# Altium schematic sheet Top level.SchDoc: Top level
size A3; ApprovedBy: FD; Engineer: AAZ; Organization: Railnova; Address1: 58 rue des tanneurs; Address2: B1000 Brussels; Address3: Belgium; SheetNumber: 1; SheetTotal: 2
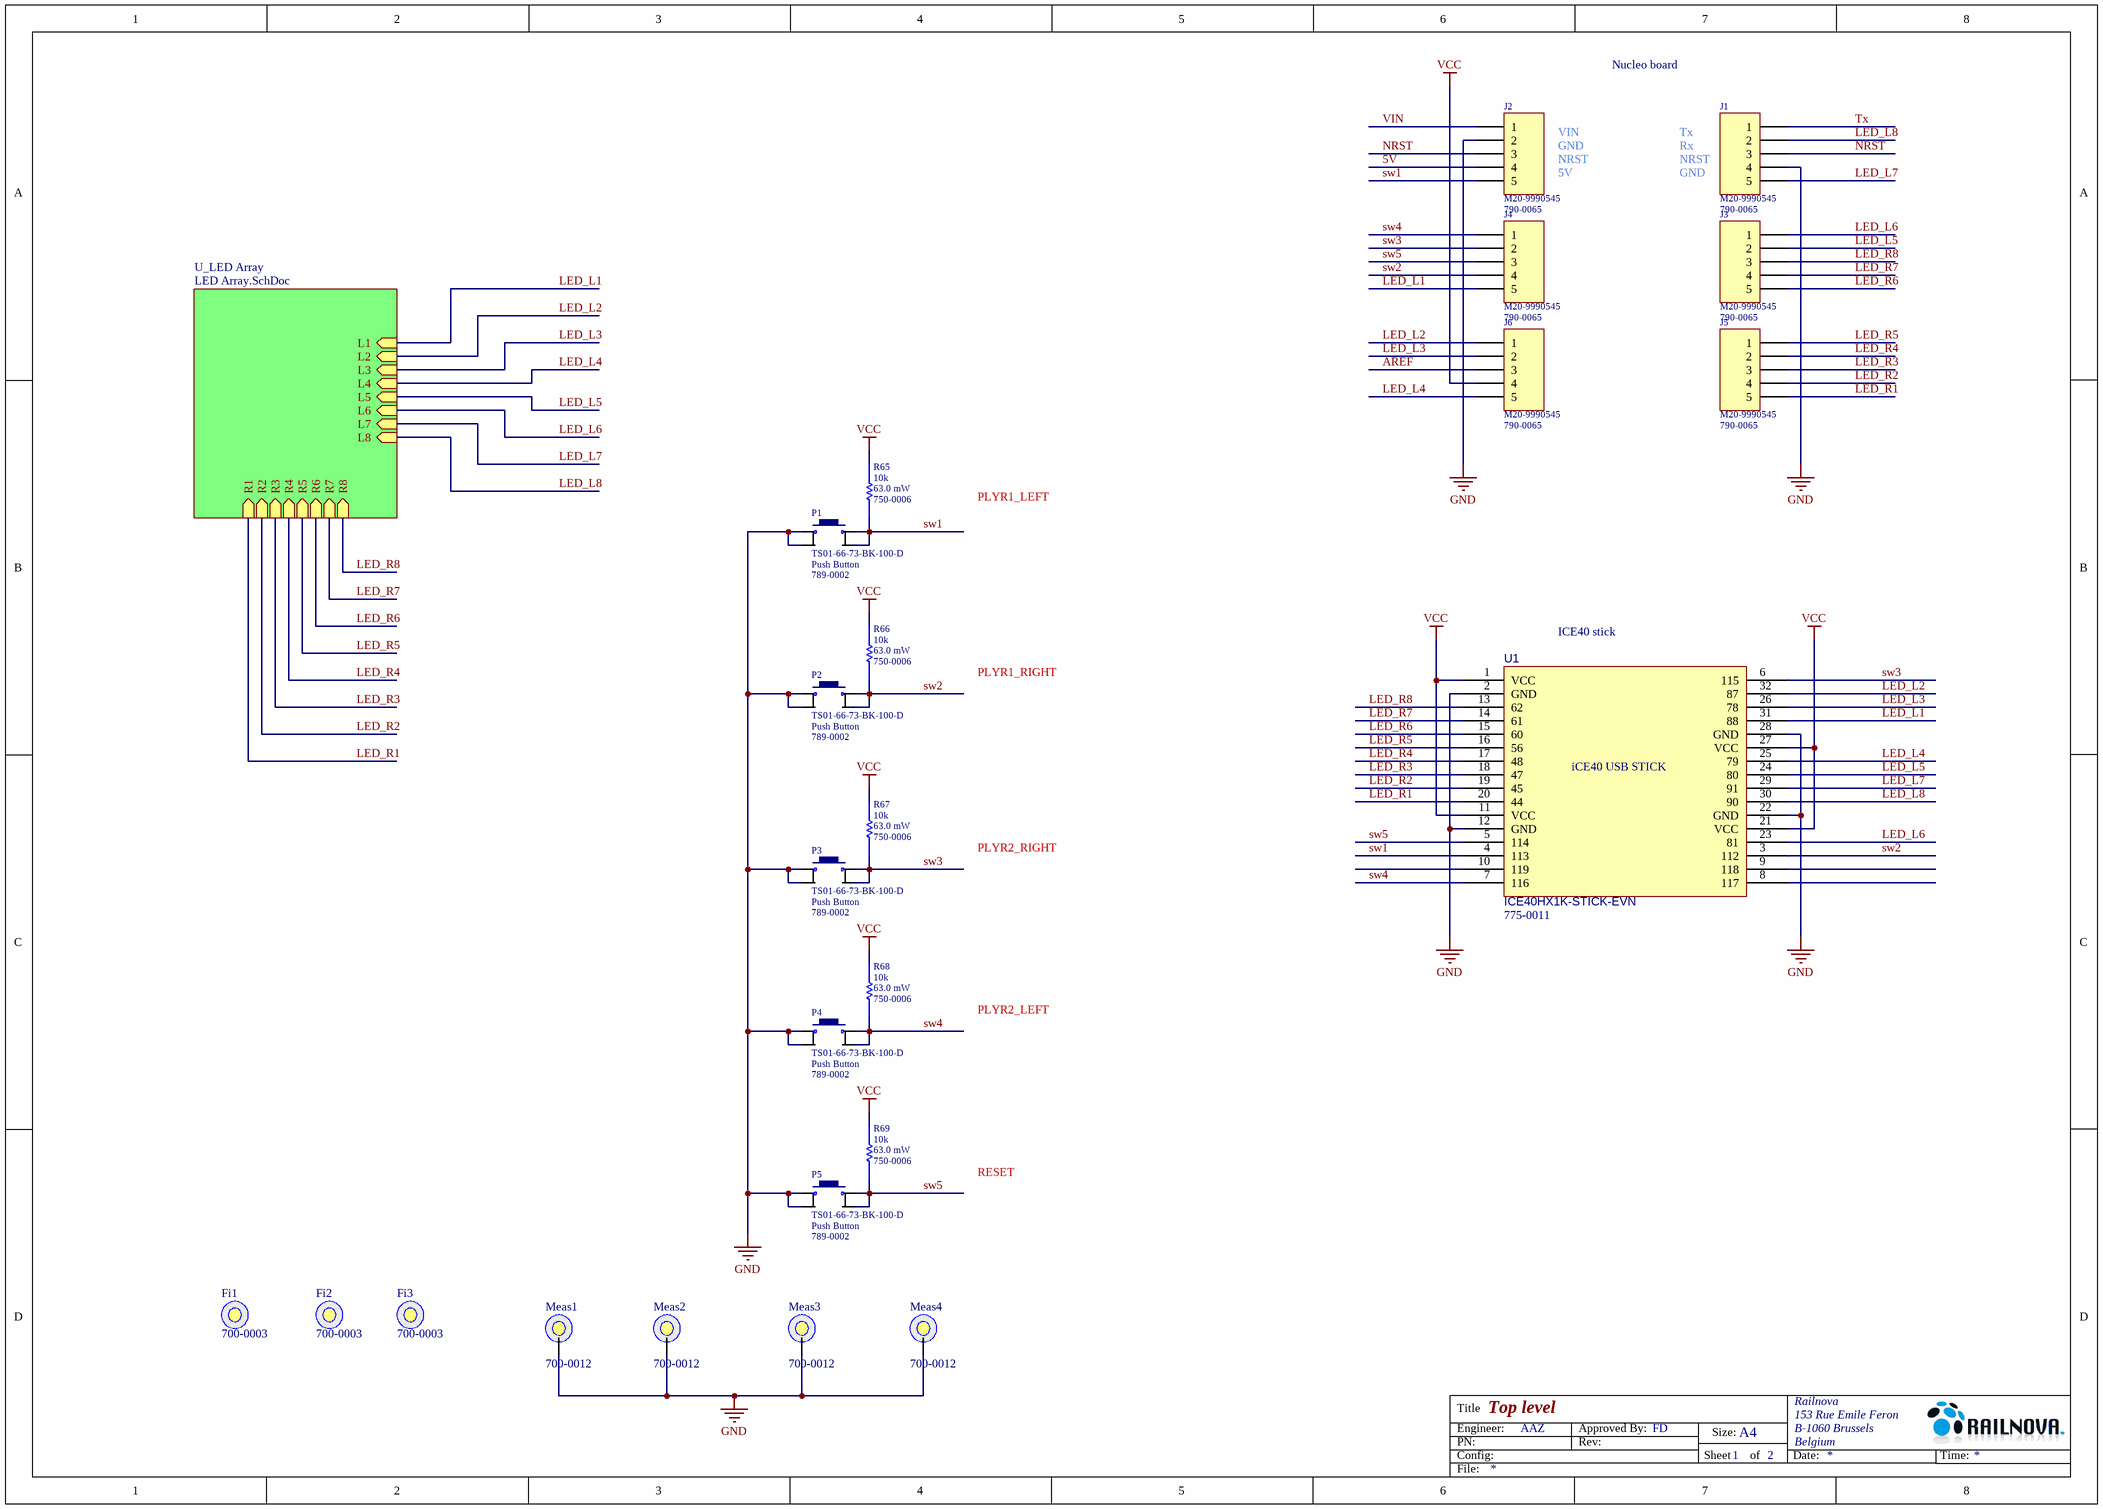
[diagram p0: Top level.SchDoc]

## Parts
Fi1  700-0003  [Fiducial_1mm]
Fi2  700-0003  [Fiducial_1mm]
Fi3  700-0003  [Fiducial_1mm]
J1  M20-9990545  Part Number: 790-0065  [CON-HDR-VER-M1X5]
J2  M20-9990545  Part Number: 790-0065  [CON-HDR-VER-M1X5]
J3  M20-9990545  Part Number: 790-0065  [CON-HDR-VER-M1X5]
J4  M20-9990545  Part Number: 790-0065  [CON-HDR-VER-M1X5]
J5  M20-9990545  Part Number: 790-0065  [CON-HDR-VER-M1X5]
J6  M20-9990545  Part Number: 790-0065  [CON-HDR-VER-M1X5]
Meas1  700-0012  [FOX_measure_point_3mm]
Meas2  700-0012  [FOX_measure_point_3mm]
Meas3  700-0012  [FOX_measure_point_3mm]
Meas4  700-0012  [FOX_measure_point_3mm]
P1  TS01-66-73-BK-100-D  Component Type: Push Button  Part Number: 789-0002  [TS01-66-70-BK]
P2  TS01-66-73-BK-100-D  Component Type: Push Button  Part Number: 789-0002  [TS01-66-70-BK]
P3  TS01-66-73-BK-100-D  Component Type: Push Button  Part Number: 789-0002  [TS01-66-70-BK]
P4  TS01-66-73-BK-100-D  Component Type: Push Button  Part Number: 789-0002  [TS01-66-70-BK]
P5  TS01-66-73-BK-100-D  Component Type: Push Button  Part Number: 789-0002  [TS01-66-70-BK]
R65  10k  Pmax: 63.0 mW  Part Number: 750-0006  [R0402-IPC-MD]
R66  10k  Pmax: 63.0 mW  Part Number: 750-0006  [R0402-IPC-MD]
R67  10k  Pmax: 63.0 mW  Part Number: 750-0006  [R0402-IPC-MD]
R68  10k  Pmax: 63.0 mW  Part Number: 750-0006  [R0402-IPC-MD]
R69  10k  Pmax: 63.0 mW  Part Number: 750-0006  [R0402-IPC-MD]
U1  ICE40HX1K-STICK-EVN  Part Number: 775-0011  [ICE-stick]

## Sub-sheets
U_LED Array = LED Array.SchDoc: R1 (in), R2 (in), R3 (in), R4 (in), R5 (in), R6 (in), R7 (in), R8 (in), L1 (in), L2 (in), L3 (in), L4 (in), L5 (in), L6 (in), L7 (in), L8 (in)

## Nets
GND: J1.4 J2.2 Meas1.pad(GND) Meas2.pad(GND) Meas3.pad(GND) Meas4.pad(GND) P1.1 P1.2 P2.1 P2.2 P3.1 P3.2 P4.1 P4.2 P5.1 P5.2 U1.2(GND) U1.12(GND) U1.22(GND) U1.28(GND)
VCC: J6.4 R65.2 R66.2 R67.2 R68.2 R69.2 U1.1(VCC) U1.11(VCC) U1.21(VCC) U1.27(VCC)
5V: J2.4
AREF: J6.3
LED_L1: J4.5 U1.31(88) ; sheet U_LED Array/L1
LED_L2: J6.1 U1.32(87) ; sheet U_LED Array/L2
LED_L3: J6.2 U1.26(78) ; sheet U_LED Array/L3
LED_L4: J6.5 U1.25(79) ; sheet U_LED Array/L4
LED_L5: J3.2 U1.24(80) ; sheet U_LED Array/L5
LED_L6: J3.1 U1.23(81) ; sheet U_LED Array/L6
LED_L7: J1.5 U1.29(91) ; sheet U_LED Array/L7
LED_L8: J1.2 U1.30(90) ; sheet U_LED Array/L8
LED_R1: J5.5 U1.20(44) ; sheet U_LED Array/R1
LED_R2: J5.4 U1.19(45) ; sheet U_LED Array/R2
LED_R3: J5.3 U1.18(47) ; sheet U_LED Array/R3
LED_R4: J5.2 U1.17(48) ; sheet U_LED Array/R4
LED_R5: J5.1 U1.16(56) ; sheet U_LED Array/R5
LED_R6: J3.5 U1.15(60) ; sheet U_LED Array/R6
LED_R7: J3.4 U1.14(61) ; sheet U_LED Array/R7
LED_R8: J3.3 U1.13(62) ; sheet U_LED Array/R8
NRST: J1.3 J2.3
sw1: J2.5 P1.3 P1.4 R65.1 U1.4(113)
sw2: J4.4 P2.3 P2.4 R66.1 U1.3(112)
sw3: J4.2 P3.3 P3.4 R67.1 U1.6(115)
sw4: J4.1 P4.3 P4.4 R68.1 U1.7(116)
sw5: J4.3 P5.3 P5.4 R69.1 U1.5(114)
Tx: J1.1
VIN: J2.1

Not connected (* = marked no-connect by the designer): U1 8(117) 9(118) 10(119)

## Notes on the sheet
- Nucleo board
- VIN
- NRST
- 5V
- GND
- Tx
- Rx
- PLYR1_LEFT
- (near U1) ICE40 stick
- PLYR1_RIGHT
- PLYR2_RIGHT
- PLYR2_LEFT
- RESET
- Title
- PN:
- Engineer:
- Config:
- Rev:
- Approved By:
- Sheet
- Size:
- A4
- of
- Date:
- Railnova
- 153 Rue Emile Feron
- B-1060 Brussels
- Belgium
- Time:
- File:
- (in symbol 775-0011) iCE40 USB STICK

## Library data of the parts
Fi1-Fi3 = 700-0003: Fiducial; Rev: A; Part Number: 700-0003; MPN: Fiducial; Status: Review; Component Type: Fiducial; MSL: NA; Revision: A; Revision Date: 2020-09-14; Revision Note: Created; Package: Fiducial; Pin Count: 1; ComponentLink1Description: ACM; ComponentLink1URL: https://acm.railnova.io/admin/altium_library/component/3/change/
J1-J6 = 790-0065: CONN REC HDR VERTICAL MALE 1X5 P0.1in; Manufacturer: HARWIN; Rows: 1; Cols: 5; Pitch: 0.1in; Vmax: 750V; Imax: 3A; Rev: A; MPN: M20-9990545; Status: Review; Component Type: REC; MSL: 1; Revision: A; Revision Date: 2020-09-14; Revision Note: Created; Package: HDR 2.54mm; Pin Count: 5; Style: HDR; Angle: VERTICAL; Gender: MALE; ComponentLink1Description: ACM; ComponentLink1URL: https://acm.railnova.io/admin/altium_library/component/326/change/
Meas1-Meas4 = 700-0012: Measuring point for FOX, 3mm without soldermask; MPN: MeasurePoint; Rev: C; Part Number: 700-0012; Status: Review; Component Type: Fiducial; MSL: NA; Revision: D; Revision Date: 2021-12-03; Revision Note: Schematic FOX_measure_point_3mm was updated on EDA-rnlib2 repository.; Package: 3mm; Pin Count: 1; ComponentLink1Description: ACM; ComponentLink1URL: https://acm.railnova.io/admin/altium_library/component/448/change/
P1-P5 = 789-0002: Push Button 6 x 6 mm, 7 mm Act Height, 100 gf, Black, Short Crimped, Through Hole, SPST; Resistance: 100mOhm; Imax: 50mA; Vmax: 12V; Pmax: 0.6W; Rev: A; MPN: TS01-66-73-BK-100-D; Status: Review; MSL: 1; Revision: B; Revision Date: 2022-04-14; Revision Note: ok; Package: WS-TUS; Pin Count: 4; Style: Through Hole; ComponentLink1Description: ACM; ComponentLink1URL: https://acm.railnova.io/admin/altium_library/component/498/change/; ComponentLink2Description: Datasheet; ComponentLink2URL: https://www.mouser.be/datasheet/2/670/ts01-2586199.pdf
R65-R69 = 750-0006: Resistor 10k 0402 1% 63.0 mW; MPN: CRCW040210K0FKED; Manufacturer: VISHAY; Tcoef: 100 ppm/C; Vmax: 50.0 V; Rev: A; Package: 0402; Status: Active; Component Type: Thick Film; MSL: 1; Value: 10k; Revision: C; Revision Date: 2021-04-21; Revision Note: OK; Pin Count: 2; Tolerance: 1%; ComponentLink1Description: ACM; ComponentLink1URL: https://acm.railnova.io/admin/altium_library/component/109/change/
U1 = 775-0011: iCE40 FPGA USB stick; Manufacturer: LATTICE SEMICONDUCTOR; Part Description: IEEE 802.11a/b/g/n Wi-Fi, Bluetooth 3.0+HS Module; Rev: A; MPN: ICE40HX1K-STICK-EVN; Status: Draft; Component Type: SOM; MSL: NA; Revision: A; Revision Date: 2022-04-14; Revision Note: Created by Abdellah Azaanoun; Package: SOM; Pin Count: 32; ComponentLink1Description: ACM; ComponentLink1URL: https://acm.railnova.io/admin/altium_library/component/501/change/; ComponentLink2Description: Datasheet; ComponentLink2URL: https://www.farnell.com/datasheets/1737019.pdf